# EasyEDA Pro project 赛博樱花灯.epro, schematic SCH_3636_v2
Board Name: c3_8311_3636_v2; Create Date: 2025-01-07; Page Name: P1; Project Name: 小智AI语音对话开发板 - C3; Schematic Name: SCH_3636_v2; Update Date: 2025-01-08; Company: terrence@tenclass.com; Page Size: A4; Version: V2.0
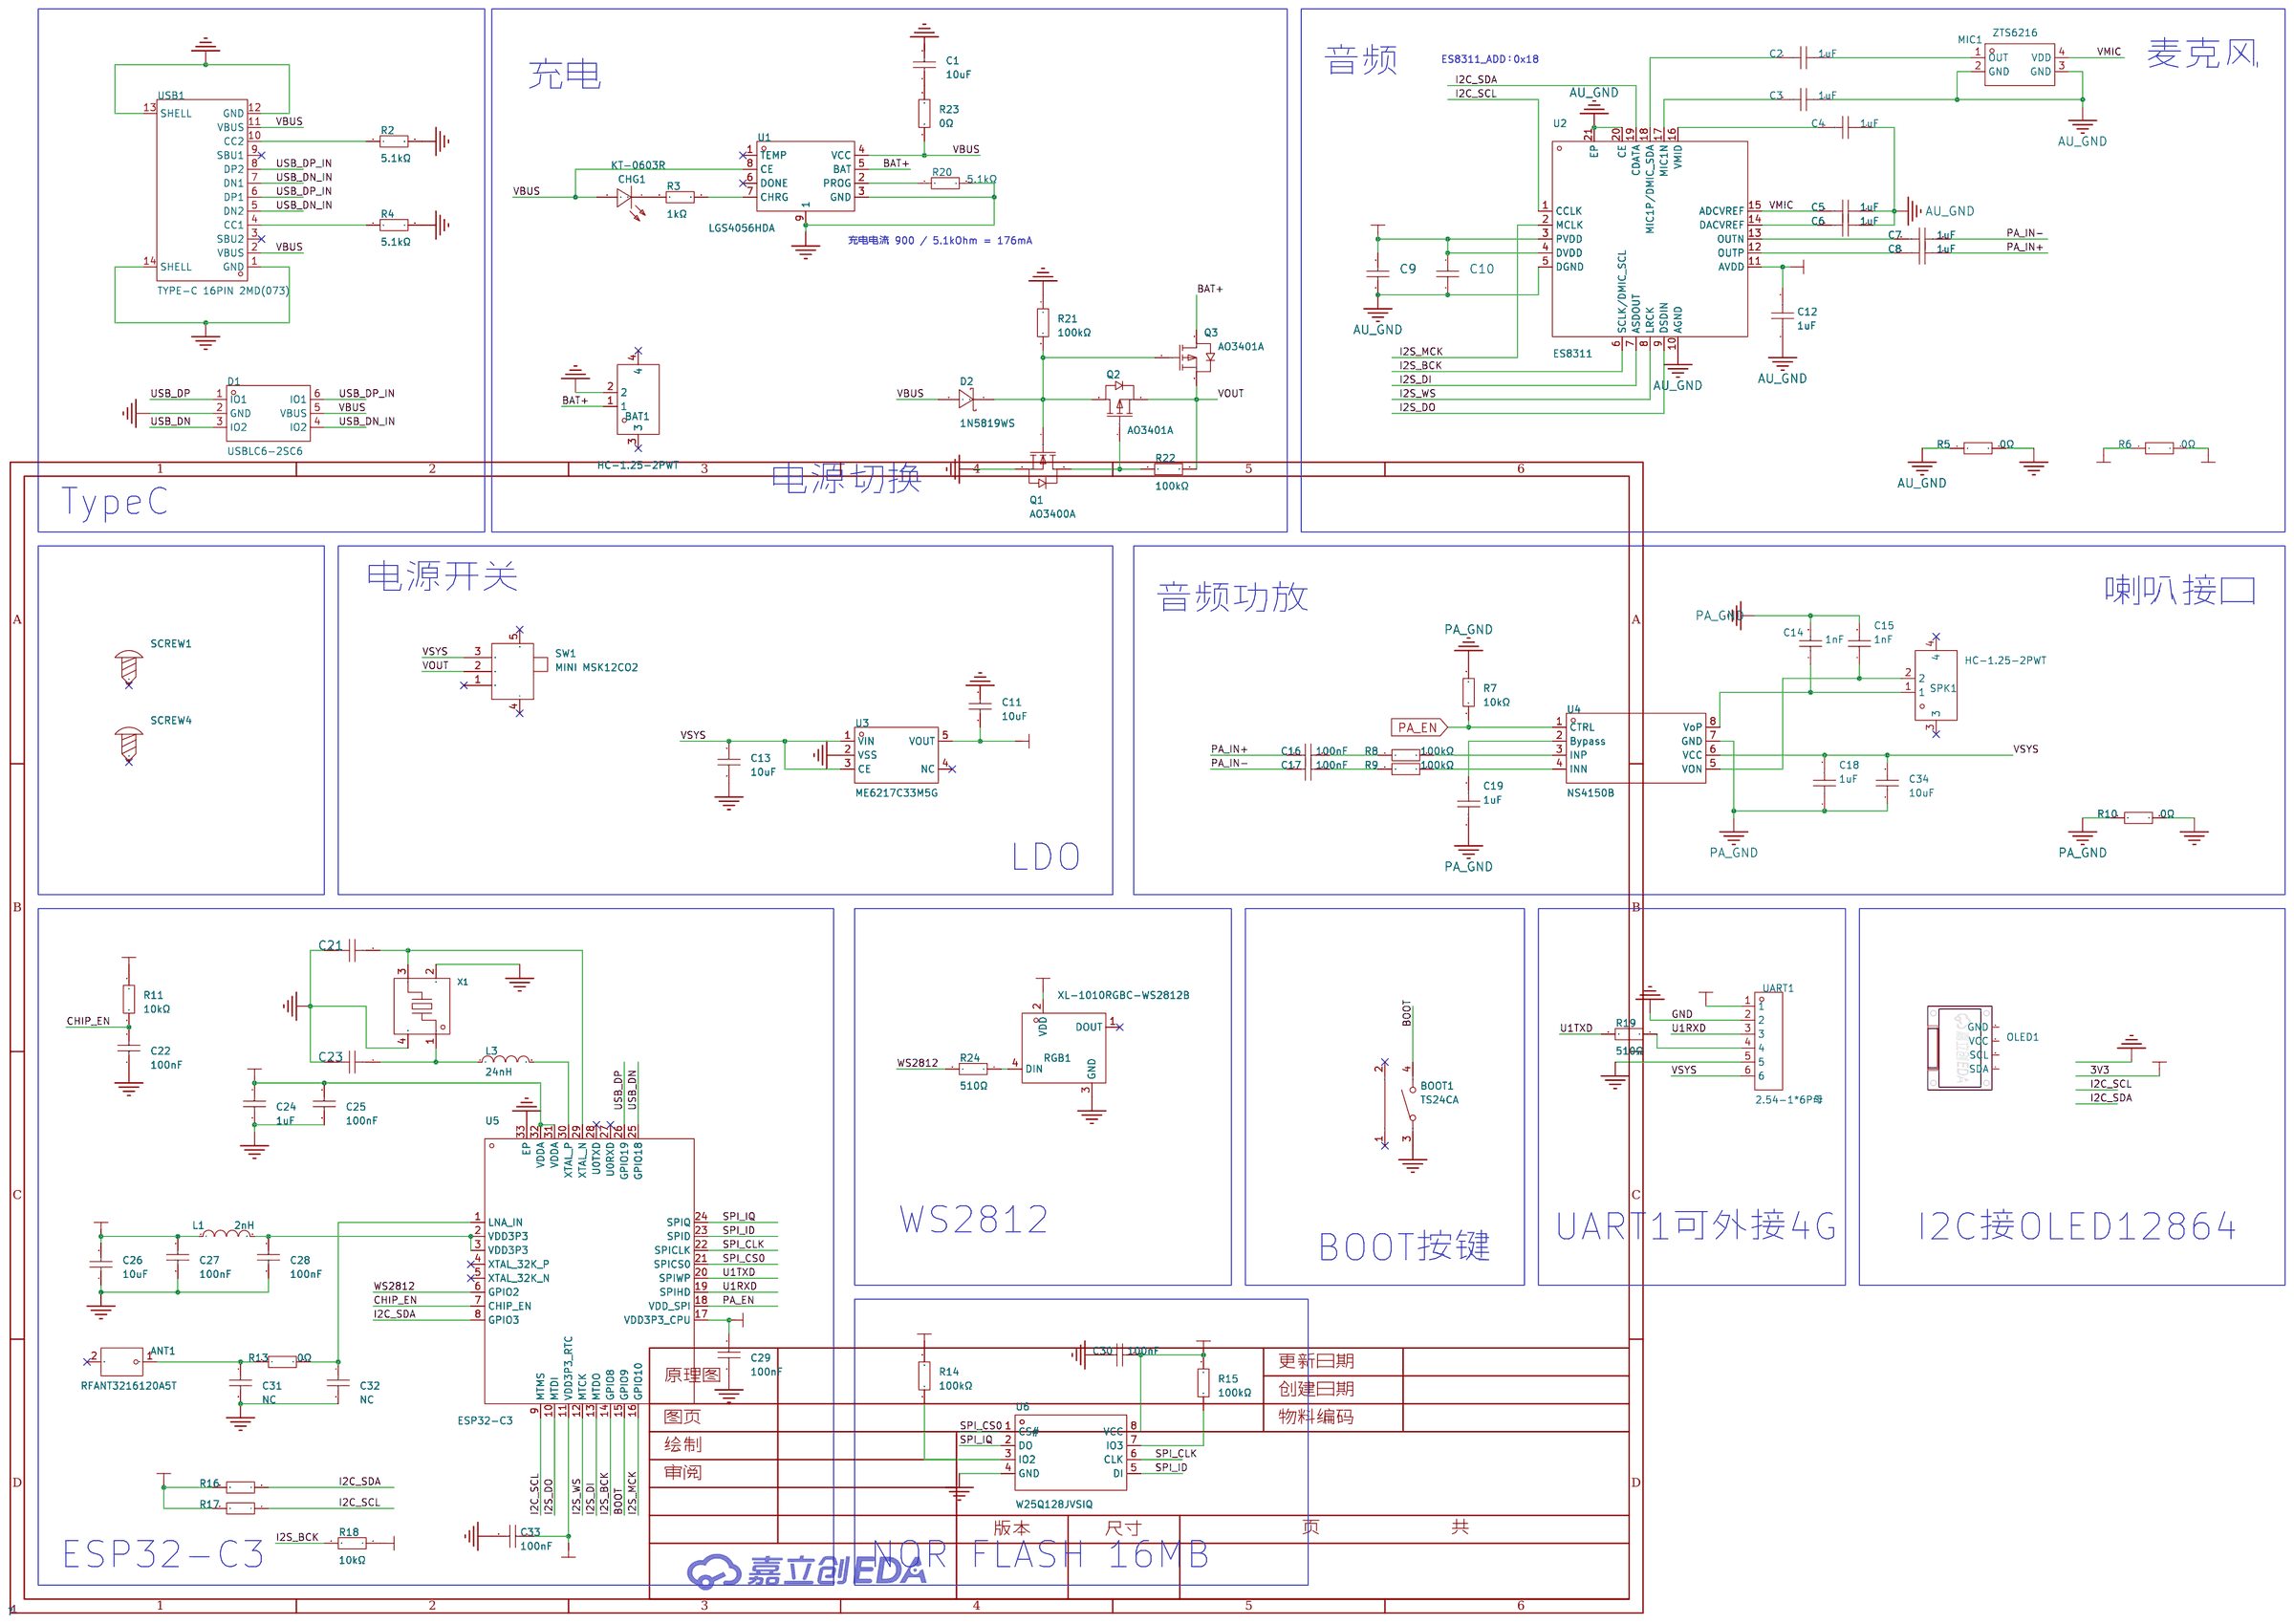
[diagram p4: schematic sheet]

## Parts
ANT1  RFANT3216120A5T  [FILTER-SMD_1206-2P-L3.2-W1.6-L]
BAT1  HC-1.25-2PWT  [CONN-SMD_2P-P1.25-HC-1.25-2PWT]
BOOT1  TS24CA  [SW-SMD_TS24CA]
C1  10uF  [C0402]
C2  1uF  [C0402]
C3  1uF  [C0402]
C4  1uF  [C0402]
C5  1uF  [C0402]
C6  1uF  [C0402]
C7  1uF  [C0402]
C8  1uF  [C0402]
C9  100nF  [C0402]
C10  100nF  [C0402]
C11  10uF  [C0402]
C12  1uF  [C0402]
C13  10uF  [C0402]
C14  1nF  [C0402]
C15  1nF  [C0402]
C16  100nF  [C0402]
C17  100nF  [C0402]
C18  1uF  [C0402]
C19  1uF  [C0402]
C21  10pF  [C0402]
C22  100nF  [C0402]
C23  10pF  [C0402]
C24  1uF  [C0402]
C25  100nF  [C0402]
C26  10uF  [C0402]
C27  100nF  [C0402]
C28  100nF  [C0402]
C29  100nF  [C0402]
C30  100nF  [C0402]
C31  NC  [C0402]
C32  NC  [C0402]
C33  100nF  [C0402]
C34  10uF  [C0402]
CHG1  KT-0603R  [LED0603-RD]
D1  USBLC6-2SC6  [SOT-23-6_L2.9-W1.6-P0.95-LS2.8-BL]
D2  1N5819WS  [SOD-323_L1.8-W1.3-LS2.5-RD]
L1  2nH  [L0402]
L3  24nH  [L0402-RD]
MIC1  ZTS6216  [MIC-SMD_4P-L2.8-W1.9-P1.84-TL]
OLED1  -  [0.96OLED_4P]
Q1  AO3400A  [SOT-23-3_L2.9-W1.3-P1.90-LS2.4-BR]
Q2  AO3401A  [SOT-23_L2.9-W1.3-P1.90-LS2.4-BR]
Q3  AO3401A  [SOT-23_L2.9-W1.3-P1.90-LS2.4-BR]
R2  5.1kΩ  [R0402]
R3  1kΩ  [R0402]
R4  5.1kΩ  [R0402]
R5  0Ω  [R0402]
R6  0Ω  [R0402]
R7  10kΩ  [R0402]
R8  100kΩ  [R0402]
R9  100kΩ  [R0402]
R10  0Ω  [R0402]
R11  10kΩ  [R0402]
R13  0Ω  [R0402]
R14  100kΩ  [R0402]
R15  100kΩ  [R0402]
R16  2.2kΩ  [R0402]
R17  2.2kΩ  [R0402]
R18  10kΩ  [R0402]
R19  510Ω  [R0402]
R20  5.1kΩ  [R0402]
R21  100kΩ  [R0402]
R22  100kΩ  [R0402]
R23  0Ω  [R0402]
R24  510Ω  [R0402]
RGB1  XL-1010RGBC-WS2812B  [LED-SMD_4P-L1.0-W1.0-TL_XL-1010RGBC-WS2812B]
SCREW1  -  [M2螺丝]
SCREW4  -  [M2螺丝]
SPK1  HC-1.25-2PWT  [CONN-SMD_2P-P1.25-HC-1.25-2PWT]
SW1  MINI MSK12CO2  [SW-SMD_MSK12CO2]
U1  LGS4056HDA  [DFN-8_L2.0-W2.0-P0.50-TL-EP1.6]
U2  ES8311  [WQFN-20_L3.0-W3.0-P0.40-BL-EP1.7]
U3  ME6217C33M5G  [SOT-23-5_L3.0-W1.7-P0.95-LS2.8-BR]
U4  NS4150B  [MSOP-8_L3.0-W3.0-P0.65-LS5.0-BL]
U5  ESP32-C3  [QFN-32_L5.0-W5.0-P0.50-TL-EP3.7]
U6  W25Q128JVSIQ  [SOIC-8_L5.3-W5.3-P1.27-LS8.0-BL]
UART1  2.54-1*6P母  [HDR-TH_6P-P2.54-V-F]
USB1  TYPE-C 16PIN 2MD(073)  [USB-C-SMD_TYPE-C-6PIN-2MD-073]
X1  40MHz  [CRYSTAL-SMD_4P-L2.5-W2.0-BL]

## Library data of the parts
ANT1 = RFANT3216120A5T: 天线类型:芯片天线;中心频点:2.4GHz;带宽:-;峰值增益:2dBi;极化方式:-;功率容量:-;驻波比:2;; LCSC Part Name: 2.4GHz ISM频段工作频率的多层陶瓷天线; Supplier Part: C127629; Manufacturer: Walsin(华新科); Supplier Footprint: 1206; JLCPCB Part Class: Extended Part; Datasheet: https://atta.szlcsc.com/upload/public/pdf/source/20180326/C127629_E7A81F7A36316F7BB6F0FA74BB27F225.pdf; Supplier: LCSC; Antenna Type: 芯片天线; Central Frequency: 2.4GHz; Peak Gain: 2dBi; VSWR: 2; Operating Temperature: -40℃~+85℃
BAT1 SPK1 = HC-1.25-2PWT: 插针结构:1x2P;间距:1.25mm;安装方式:卧贴;参考系列:PicoBlade(MX 1.25);总PIN数:2P;排数:1;每排PIN数:2;行距:-;额定电流:1A;触头材质:黄铜;触头镀层:锡;工作温度范围:-40℃~+105℃;; LCSC Part Name: 1x2P 间距:1.25mm 卧贴 系列:PicoBlade(MX 1.25); Supplier Part: C2845379; Manufacturer: HCTL(华灿天禄); Supplier Footprint: SMD,P=1.25mm,卧贴; JLCPCB Part Class: Extended Part; Datasheet: https://atta.szlcsc.com/upload/public/pdf/source/20240930/9508A8292CCC87B0C29E3A028D56E30A.pdf; Supplier: LCSC; Pins Structure: 1x2P; Pitch: 1.25mm; Mounting Style: 卧贴; Reference Series: PicoBlade(MX 1.25); Number of Pins: 2P; Number of Rows: 1; Number of PINs Per Row: 2; Current Rating (Max): 1A; Contact Material: 黄铜; Contact Plating: 锡; Operating Temperature Range: -40℃~+105℃; Rated Voltage (Max): 125V; Plastic Material: LCP; Flame Retardant Rating: UL94V-0; Supplementary Features: 辅助焊脚; Z-Height of the Board: 3.57mm; X-Length of Bottom Edge on Board (Spacing Line): 7.55mm; Y-Width of Bottom Edge on Board: 5.25mm
BOOT1 = TS24CA: 电路结构:单刀单掷;按钮形状:矩形按钮;安装方式:卧贴;开关长度:4.55mm;开关宽度:1.8mm;开关高度:3.5mm;触点电流:50mA;额定电压(DC):12V;带灯:-;机械寿命:-;; LCSC Part Name: 4.55*1.8*3.5mm 卧贴 轻触开关; Supplier Part: C393942; Manufacturer: SHOU HAN(首韩); Supplier Footprint: SMD; JLCPCB Part Class: Extended Part; Datasheet: https://atta.szlcsc.com/upload/public/pdf/source/20190521/C393942_591A9E318887EFA4274D34029981AD99.pdf; Supplier: LCSC; Circuit: 单刀单掷; Actuator Style: 矩形按钮; Mounting Style: 卧贴; Switch Length: 4.55mm; Switch Width: 1.8mm; Switch Height: 3.5mm; Contact Current: 50mA; Voltage Rating (DC): 12V
C1 C11 C13 C26 C34 = CL05A106MQ5NUNC: 容值:10uF;精度:±20%;额定电压:6.3V;材质(温度系数):X5R;; LCSC Part Name: 10uF ±20% 6.3V; Supplier Part: C15525; Manufacturer: SAMSUNG(三星); Supplier Footprint: 0402; JLCPCB Part Class: Basic Part; Datasheet: https://atta.szlcsc.com/upload/public/pdf/source/20220823/2B02EE04F8F211D38A52DCB16EB6BEBA.pdf; Supplier: LCSC; Tolerance: ±20%; Voltage Rated: 6.3V; Temperature Coefficient: X5R
C2 C3 = CL05A105KA5NQNC: 容值:1uF;精度:±10%;额定电压:25V;材质(温度系数):X5R;; LCSC Part Name: 1uF ±10% 25V; Supplier Part: C52923; Manufacturer: SAMSUNG(三星); Supplier Footprint: 0402; JLCPCB Part Class: Basic Part; Datasheet: https://atta.szlcsc.com/upload/public/pdf/source/20160218/1457707763339.pdf; Supplier: LCSC; Tolerance: ±10%; Voltage Rated: 25V; Temperature Coefficient: X5R
C4-C8 C12 C18 C19 = CL05A105KA5NQNC: 容值:1uF;精度:±10%;额定电压:25V;材质(温度系数):X5R;; LCSC Part Name: 1uF ±10% 25V; Supplier Part: C52923; Manufacturer: SAMSUNG(三星); Supplier Footprint: 0402; JLCPCB Part Class: 基础库; Datasheet: https://atta.szlcsc.com/upload/public/pdf/source/20160218/1457707763339.pdf; Supplier: LCSC; Tolerance: ±10%; Voltage Rated: 25V; Temperature Coefficient: X5R; Check: true
C9 C10 = CL05B104KO5NNNC: 容值:100nF;精度:±10%;额定电压:16V;材质(温度系数):X7R;; LCSC Part Name: 100nF ±10% 16V; Supplier Part: C1525; Manufacturer: SAMSUNG(三星); Supplier Footprint: 0402; JLCPCB Part Class: Basic Part; Datasheet: https://atta.szlcsc.com/upload/public/pdf/source/20160218/1457707763339.pdf; Supplier: LCSC; Tolerance: ±10%; Voltage Rated: 16V; Temperature Coefficient: X7R
C14 C15 = 0402B102K500NT: 容值:1nF;精度:±10%;额定电压:50V;材质(温度系数):X7R;; LCSC Part Name: 1nF ±10% 50V; Supplier Part: C1523; Manufacturer: FH(风华); Supplier Footprint: 0402; JLCPCB Part Class: Basic Part; Datasheet: https://atta.szlcsc.com/upload/public/pdf/source/20200305/C486355_26A10D38EF8C2A5C37091D0039909270.pdf; Supplier: LCSC; Tolerance: ±10%; Voltage Rated: 50V; Temperature Coefficient: X7R
C16 C17 C22 C25 C27-C30 C33 = CL05B104KO5NNNC: 容值:100nF;精度:±10%;额定电压:16V;材质(温度系数):X7R;; LCSC Part Name: 100nF ±10% 16V; Supplier Part: C1525; Manufacturer: SAMSUNG(三星); Supplier Footprint: 0402; JLCPCB Part Class: 基础库; Datasheet: https://atta.szlcsc.com/upload/public/pdf/source/20160218/1457707763339.pdf; Supplier: LCSC; Tolerance: ±10%; Voltage Rated: 16V; Temperature Coefficient: X7R; Check: true
C21 C23 = CL05C100JB5NNNC: 容值:10pF;精度:±5%;额定电压:50V;材质(温度系数):C0G;; LCSC Part Name: 10pF ±5% 50V; Supplier Part: C32949; Manufacturer: SAMSUNG(三星); Supplier Footprint: 0402; JLCPCB Part Class: Basic Part; Datasheet: https://atta.szlcsc.com/upload/public/pdf/source/20160218/1457707763339.pdf; Supplier: LCSC; Tolerance: ±5%; Voltage Rated: 50V; Temperature Coefficient: C0G
C24 = CL05A105KA5NQNC: 容值:1uF;精度:±10%;额定电压:25V;材质(温度系数):X5R;; LCSC Part Name: 1uF ±10% 25V; Supplier Part: C52923; Manufacturer: SAMSUNG(三星); Supplier Footprint: 0402; JLCPCB Part Class: Basic Part; Datasheet: https://atta.szlcsc.com/upload/public/pdf/source/20160218/1457707763339.pdf; Supplier: LCSC; Tolerance: ±10%; Voltage Rated: 25V; Temperature Coefficient: X5R; Check: true
C31 C32 = CL05B104KO5NNNC: 容值:100nF;精度:±10%;额定电压:16V;材质(温度系数):X7R;; LCSC Part Name: 100nF ±10% 16V; Supplier Part: C1525; Manufacturer: SAMSUNG(三星); Supplier Footprint: 0402; JLCPCB Part Class: 基础库; Datasheet: https://atta.szlcsc.com/upload/public/pdf/source/20160218/1457707763339.pdf; Supplier: LCSC; Tolerance: ±10%; Voltage Rated: 16V; Temperature Coefficient: X7R
CHG1 = KT-0603R: 发光颜色:红色;功率:-;正向电流:-;主波长:-;二极管配置:-;透镜颜色:-;色温:-;发光角度:-;载带方式:-;工作温度:-40℃~+85℃;; LCSC Part Name: 0603 红灯 高亮; Supplier Part: C2286; Manufacturer: KENTO; Supplier Footprint: 0603; JLCPCB Part Class: 基础库; Datasheet: https://atta.szlcsc.com/upload/public/pdf/source/20160616/1466072038404.pdf; Supplier: LCSC; Emitted Color: 红色; Operating Temperature: -40℃~+85℃
D1 = USBLC6-2SC6_C2827654: 极性:单向;反向截止电压(Vrwm):5V;最大钳位电压:12V;峰值脉冲电流(Ipp):6A;峰值脉冲功率(Ppp):150W;击穿电压:6V;; LCSC Part Name: ESD，可防30kV静电; Supplier Part: C2827654; Manufacturer: TECH PUBLIC(台舟); Supplier Footprint: SOT-23-6; JLCPCB Part Class: 扩展库; Datasheet: https://atta.szlcsc.com/upload/public/pdf/source/20210810/FBD75DE717D6D97BAC6DD7F2B5C09DCD.pdf; Supplier: LCSC; polarity: 单向; Reverse Stand-Off Voltage (Vrwm): 5V; Maximum Clamping Voltage: 12V; Peak Pulse Current (Ipp): 6A; Peak Pulse Power Dissipation (Ppp): 150W; Breakdown Voltage: 6V; Reverse Leakage Current (Ir): 80nA; Number of Lines: 双路; Operating Temperature: -55℃~+125℃; level of protection: IEC 61000-4-2; Type: ESD
D2 = 1N5819WS_C191023: 正向压降(Vf):600mV@1A;直流反向耐压(Vr):40V;平均整流电流(Io):1A;; LCSC Part Name: 电压:40V 电流:1A; Supplier Part: C191023; Manufacturer: Hottech(合科泰); Supplier Footprint: SOD-323; JLCPCB Part Class: 基础库; Datasheet: https://atta.szlcsc.com/upload/public/pdf/source/20220428/3CB86FD8D28D653594B4E35F9D5AEFD9.pdf; Supplier: LCSC; Forward Voltage (Vf@If): 600mV@1A; Reverse Voltage (Vr): 40V; Average Rectified Current (Io): 1A
L1 = LQG15HS2N0S02D: 电感值:2nH;精度:-;额定电流:900mA;饱和电流(Isat):-;直流电阻(DCR):90mΩ;; LCSC Part Name: 2nH ±0.3nH; Supplier Part: C18216; Manufacturer: muRata(村田); Supplier Footprint: 0402; Datasheet: https://atta.szlcsc.com/upload/public/pdf/source/20190514/C18216_4C6D770518CF7A3B206943E09D2940CE.pdf; Supplier: LCSC; Rated Current: 900mA; DC Resistance (DCR): 90mΩ; Q @ Freq: 8@100MHz; Frequency - Self Resonant: 6GHz; Check: true
L3 = SDCL1005C24NJTDF: 电感值:24nH;精度:±5%;额定电流:-;饱和电流(Isat):-;直流电阻(DCR):-;; LCSC Part Name: 24nH ±5%; Supplier Part: C74301; Manufacturer: Sunlord(顺络); Supplier Footprint: 0402; Datasheet: https://atta.szlcsc.com/upload/public/pdf/source/20210916/2389196E6DC4CA1121B2D3610B126F46.pdf; Supplier: LCSC; Tolerance: ±5%; Check: true
MIC1 = ZTS6216: 方向:全指向;信噪比:65dB;灵敏度:-38dB;阻抗:100Ω;; Supplier Part: C481302; Manufacturer: ZILLTEK(钰太); Supplier Footprint: SMD-4P,1.9x2.8mm; JLCPCB Part Class: Extended Part; Datasheet: https://atta.szlcsc.com/upload/public/pdf/source/20200316/C481302_3CBECE2A7DED4DFD53CEA082844189F4.pdf; Supplier: LCSC; Direction: 全指向; Sensitivity: -38dB; SNR(Signal to Noise Ratio): 65dB; Current Consumption: 120uA; Supply Voltage: 1.5V~3.6V; Impedance: 100Ω
OLED1 = 0.96OLED模块_4P: Supplier Footprint: 插件
Q1 = AO3400A_C20917: 类型:1个N沟道;漏源电压(Vdss):30V;连续漏极电流(Id):5.7A;导通电阻(RDS(on)@Vgs,Id):26.5mΩ@10V,5.7A;功率(Pd):1.4W;阈值电压(Vgs(th)@Id):1.5V@250uA;; LCSC Part Name: 1个N沟道 耐压:30V 电流:5.7A; Supplier Part: C20917; Manufacturer: AOS; Supplier Footprint: SOT-23-3L; JLCPCB Part Class: 基础库; Datasheet: https://atta.szlcsc.com/upload/public/pdf/source/20140107/1457706668533.pdf; Supplier: LCSC; Type: 1个N沟道; Drain Source Voltage (Vdss): 30V; Continuous Drain Current (Id): 5.7A; Drain Source On Resistance (RDS(on)@Vgs,Id): 26.5mΩ@10V,5.7A; Power Dissipation (Pd): 1.4W; Gate Threshold Voltage (Vgs(th)@Id): 1.5V@250uA; Total Gate Charge (Qg@Vgs): 7nC@4.5V; Input Capacitance (Ciss@Vds): 630pF@15V; Operating Temperature: -55℃~+150℃@(Tj)
Q2 Q3 = AO3401A_C15127: 类型:1个P沟道;漏源电压(Vdss):30V;连续漏极电流(Id):4A;导通电阻(RDS(on)@Vgs,Id):44mΩ@10V,4.3A;功率(Pd):1.4W;阈值电压(Vgs(th)@Id):1.3V@250uA;; LCSC Part Name: 1个P沟道 耐压:30V 电流:4A; Supplier Part: C15127; Manufacturer: AOS; Supplier Footprint: SOT-23; JLCPCB Part Class: 基础库; Datasheet: https://atta.szlcsc.com/upload/public/pdf/source/20160507/1462613609053.pdf; Supplier: LCSC; Type: 1个P沟道; Drain Source Voltage (Vdss): 30V; Continuous Drain Current (Id): 4A; Drain Source On Resistance (RDS(on)@Vgs,Id): 44mΩ@10V,4.3A; Power Dissipation (Pd): 1.4W; Gate Threshold Voltage (Vgs(th)@Id): 1.3V@250uA; Total Gate Charge (Qg@Vgs): 12.2nC@4.5V; Input Capacitance (Ciss@Vds): 1.2nF@15V; Operating Temperature: -55℃~+150℃@(Tj)
R2 R4 R20 = 0402WGF5101TCE: 电阻类型:厚膜电阻;阻值:5.1kΩ;精度:±1%;功率:62.5mW;最大工作电压:50V;温度系数:±100ppm/℃;; LCSC Part Name: 5.1kΩ ±1% 62.5mW 厚膜电阻; Supplier Part: C25905; Manufacturer: UNI-ROYAL(厚声); Supplier Footprint: 0402; JLCPCB Part Class: 基础库; Datasheet: https://atta.szlcsc.com/upload/public/pdf/source/20200306/C422600_1E6D84923E4A46A82E41ADD87F860B5C.pdf; Supplier: LCSC; Type: 厚膜电阻; Tolerance: ±1%; Power(Watts): 62.5mW; Overload Voltage (Max): 50V; Temperature Coefficient: ±100ppm/℃; Operating Temperature Range: -55℃~+155℃; Check: true
R3 = 0402WGF1001TCE: 电阻类型:厚膜电阻;阻值:1kΩ;精度:±1%;功率:62.5mW;最大工作电压:50V;温度系数:±100ppm/℃;; LCSC Part Name: 1kΩ ±1% 62.5mW 厚膜电阻; Supplier Part: C11702; Manufacturer: UNI-ROYAL(厚声); Supplier Footprint: 0402; JLCPCB Part Class: Basic Part; Datasheet: https://atta.szlcsc.com/upload/public/pdf/source/20200306/C422600_1E6D84923E4A46A82E41ADD87F860B5C.pdf; Supplier: LCSC; Type: 厚膜电阻; Tolerance: ±1%; Power(Watts): 62.5mW; Overload Voltage (Max): 50V; Temperature Coefficient: ±100ppm/℃; Operating Temperature Range: -55℃~+155℃
R5 R6 R10 R23 = 0402WGF0000TCE: 电阻类型:厚膜电阻;阻值:0Ω;精度:±1%;功率:62.5mW;; LCSC Part Name: 0Ω ±1% 62.5mW; Supplier Part: C17168; Manufacturer: UNI-ROYAL(厚声); Supplier Footprint: 0402; Datasheet: https://atta.szlcsc.com/upload/public/pdf/source/20200306/C422600_1E6D84923E4A46A82E41ADD87F860B5C.pdf; Supplier: LCSC; Type: 厚膜电阻; Tolerance: ±1%; Power(Watts): 62.5mW; Temperature Coefficient: ±800ppm/℃; Overload Voltage (Max): 50V; Operating Temperature Range: -55℃~+155℃; Check: true
R7 R11 R18 = 0402WGF1002TCE: 电阻类型:厚膜电阻;阻值:10kΩ;精度:±1%;功率:62.5mW;最大工作电压:50V;温度系数:±100ppm/℃;; LCSC Part Name: 10kΩ ±1% 62.5mW 厚膜电阻; Supplier Part: C25744; Manufacturer: UNI-ROYAL(厚声); Supplier Footprint: 0402; JLCPCB Part Class: 基础库; Datasheet: https://atta.szlcsc.com/upload/public/pdf/source/20200306/C422600_1E6D84923E4A46A82E41ADD87F860B5C.pdf; Supplier: LCSC; Type: 厚膜电阻; Tolerance: ±1%; Power(Watts): 62.5mW; Overload Voltage (Max): 50V; Temperature Coefficient: ±100ppm/℃; Operating Temperature Range: -55℃~+155℃; Check: true
R8 R9 R14 R15 R21 R22 = 0402WGF1003TCE: 电阻类型:厚膜电阻;阻值:100kΩ;精度:±1%;功率:62.5mW;; LCSC Part Name: 100kΩ ±1% 62.5mW; Supplier Part: C25741; Manufacturer: UNI-ROYAL(厚声); Supplier Footprint: 0402; JLCPCB Part Class: 基础库; Datasheet: https://atta.szlcsc.com/upload/public/pdf/source/20200306/C422600_1E6D84923E4A46A82E41ADD87F860B5C.pdf; Supplier: LCSC; Type: 厚膜电阻; Tolerance: ±1%; Power(Watts): 62.5mW; Temperature Coefficient: ±100ppm/℃; Overload Voltage (Max): 50V; Operating Temperature Range: -55℃~+155℃; Check: true
R13 = 0402WGF0000TCE: 电阻类型:厚膜电阻;阻值:0Ω;精度:±1%;功率:62.5mW;最大工作电压:50V;温度系数:±800ppm/℃;; LCSC Part Name: 0Ω ±1% 62.5mW; Supplier Part: C17168; Manufacturer: UNI-ROYAL(厚声); Supplier Footprint: 0402; JLCPCB Part Class: Basic Part; Datasheet: https://atta.szlcsc.com/upload/public/pdf/source/20200306/C422600_1E6D84923E4A46A82E41ADD87F860B5C.pdf; Supplier: LCSC; Type: 厚膜电阻; Tolerance: ±1%; Power(Watts): 62.5mW; Temperature Coefficient: ±800ppm/℃; Overload Voltage (Max): 50V; Operating Temperature Range: -55℃~+155℃; Check: true
R16 R17 = 0402WGF2201TCE: 电阻类型:厚膜电阻;阻值:2.2kΩ;精度:±1%;功率:62.5mW;最大工作电压:50V;温度系数:±100ppm/℃;; LCSC Part Name: 2.2kΩ ±1% 62.5mW 厚膜电阻; Supplier Part: C25879; Manufacturer: UNI-ROYAL(厚声); Supplier Footprint: 0402; JLCPCB Part Class: Basic Part; Datasheet: https://atta.szlcsc.com/upload/public/pdf/source/20200306/C422600_1E6D84923E4A46A82E41ADD87F860B5C.pdf; Supplier: LCSC; Type: 厚膜电阻; Tolerance: ±1%; Power(Watts): 62.5mW; Overload Voltage (Max): 50V; Temperature Coefficient: ±100ppm/℃; Operating Temperature Range: -55℃~+155℃
R19 R24 = 0402WGF5100TCE: 电阻类型:厚膜电阻;阻值:510Ω;精度:±1%;功率:62.5mW;最大工作电压:50V;温度系数:±100ppm/℃;; LCSC Part Name: 510Ω ±1% 62.5mW 厚膜电阻; Supplier Part: C25123; Manufacturer: UNI-ROYAL(厚声); Supplier Footprint: 0402; JLCPCB Part Class: Basic Part; Datasheet: https://atta.szlcsc.com/upload/public/pdf/source/20200306/C422600_1E6D84923E4A46A82E41ADD87F860B5C.pdf; Supplier: LCSC; Type: 厚膜电阻; Tolerance: ±1%; Power(Watts): 62.5mW; Overload Voltage (Max): 50V; Temperature Coefficient: ±100ppm/℃; Operating Temperature Range: -55℃~+155℃
RGB1 = XL-1010RGBC-WS2812B: 0404幻彩/1010幻彩 ws2812B 内置驱动IC 小尺寸幻彩; Supplier Part: C5349953; Manufacturer: XINGLIGHT(成兴光); Supplier Footprint: SMD,1x1mm; JLCPCB Part Class: Extended Part; Datasheet: https://atta.szlcsc.com/upload/public/pdf/source/20240218/17D2BD8F4295D202E0F5662BF6E5539A.pdf; Supplier: LCSC
SCREW1 SCREW4 = M2螺丝: Supplier Footprint: 插件
SW1 = MINI MSK12CO2: 电路结构:单刀双掷;安装方式:卧贴;开关颜色:-;额定电流(DC):50mA;额定电压(DC):12V;额定电流(AC):-;额定电压(AC):-;机械寿命:1万次;; LCSC Part Name: 迷你七脚两档侧拨拨动 mini七7脚 微型拨动; Supplier Part: C2681570; Manufacturer: SHOU HAN(首韩); Supplier Footprint: SMD; JLCPCB Part Class: 扩展库; Datasheet: https://atta.szlcsc.com/upload/public/pdf/source/20210224/C2681570_D263F9C605E4588A4AE6114B72AE4C72.pdf; Supplier: LCSC; Circuit: 单刀双掷; Pin Style: SMD接片; Switch Length: 5mm; Switch Width: 2.75mm; Switch Height: 1.4mm; Mounting Style: 卧贴; Current Rating (DC): 50mA; Voltage Rating (DC): 12V; Mechanical Life: 1万次; Operating Temperature: -16℃~+60℃
U1 = LGS4056HDA: 电源电压:4V~6V;最大充电电流:1A;电池类型:锂离子/聚合物;电池节数:1;; LCSC Part Name: TP4056H(DFN); Supplier Part: C5124109; Manufacturer: Legend-Si(棱晶半导体); Supplier Footprint: DFN-8(2x2); JLCPCB Part Class: 扩展库; Datasheet: https://atta.szlcsc.com/upload/public/pdf/source/20230407/EF281A5928E4D64337F5505487E44644.pdf; Supplier: LCSC; The Chip Type: 线性充电芯片; Supply Voltage: 4V~6V; Maximum Charge Current: 1A; Charging Saturation Voltage: 4.2V; Type of Battery: 锂离子/聚合物; Number of Cells: 1; Operating Temperature: -40℃~+125℃
U2 = ES8311: Supplier Part: C962342; Manufacturer: Everest-semi(顺芯); Supplier Footprint: WQFN-20-EP(3x3); JLCPCB Part Class: 扩展库; Datasheet: https://atta.szlcsc.com/upload/public/pdf/source/20210630/C962342_E665EAE7274179BC7C5A390EC8AC685C.pdf; Supplier: LCSC; Check: true
U3 = ME6217C33M5G: 输出类型:固定;输出极性:正;最大输入电压:7V;输出电压:3.3V;输出电流:800mA;电源纹波抑制比(PSRR):65dB@(1kHz);; Supplier Part: C427602; Manufacturer: MICRONE(南京微盟); Supplier Footprint: SOT-23-5; Datasheet: https://atta.szlcsc.com/upload/public/pdf/source/20190910/C427602_D4B9162A2E9D9EF57C60010DFDECEF37.pdf; Supplier: LCSC; Output Type: 固定; Output Polarity: 正; Number of Outputs: 1; Maximum Input Voltage: 7V; Output Voltage: 3.3V; Dropout Voltage: 180mV@(300mA); Output Current: 800mA; Power Supply Rejection Ratio (PSRR): 65dB@(1kHz); Check: true
U4 = NS4150B_C189961: 功放类型:Class D;输出功率:3Wx1@4Ω;; Supplier Part: C189961; Manufacturer: Nsiway(纳芯威); Supplier Footprint: MSOP-8; Datasheet: https://atta.szlcsc.com/upload/public/pdf/source/20220916/DAE631F3909B9CBB38BDE76E3E6D5896.pdf; Supplier: LCSC; Type of Power Amplifier: Class D; Output Power: 3Wx1@4Ω; Supply Voltage: 3V~5.25V; Check: true
U5 = ESP32-C3: CPU内核:RISC-V;CPU最大主频:160MHz;工作电压范围:3V~3.6V;程序存储容量:-;程序存储器类型:-;RAM总容量:400KB;GPIO端口数量:22;; Supplier Part: C2838500; Manufacturer: ESPRESSIF(乐鑫); Supplier Footprint: QFN-32-EP(5x5); JLCPCB Part Class: 扩展库; Datasheet: https://atta.szlcsc.com/upload/public/pdf/source/20210625/C2838500_6489BE4707B1A2880AF92BF6724D19CA.pdf; Supplier: LCSC; CPU Core: RISC-V; CPU Maximum Speed: 160MHz; Operating Voltage Range: 3V~3.6V; RAM Size: 400KB; GPIO Ports Number: 22; ADC (Bit): 12bit; UART/USART: 2; I2C: 1; I2S: 1; SPI: 3; Peripheral/Function: 蓝牙协议栈；片载温度传感器；真随机数发生器；DMA；看门狗；WIFI协议栈；硬件密码算法引擎；54位Timer；PWM；RTC实时时钟; communication protocol: 蓝牙协议；WIFI协议; Watchdog: 有; Real-Time Clock: 有; Direct Memory Access: 有; Operating Temperature Range: -40℃~+105℃; Check: true
U6 = W25Q128JVSIQ: 接口类型:SPI;存储容量:128Mbit;时钟频率(fc):133MHz;; LCSC Part Name: W25Q128JVSIQ 编带; Supplier Part: C97521; Manufacturer: WINBOND(华邦); Supplier Footprint: SOIC-8-208mil; JLCPCB Part Class: 基础库; Datasheet: https://atta.szlcsc.com/upload/public/pdf/source/20170316/1489627409956.pdf; Supplier: LCSC; Interface Type: SPI; Memory Size: 128Mbit; Clock Frequency (fc): 133MHz; Supply Voltage: 2.7V~3.6V; Page Programming Time (Tpp): 700us; Block Erase Time (tBE): 120ms@(32KB); Data Retention - TDR (Year): 20年; Operating Temperature: -40℃~+85℃; Check: true
UART1 = 2.54-1*6P母: 插孔结构:1x6P;间距:2.54mm;行距:-;安装类型:直插;排数:单排;总孔位数:6P;塑高:-;触头材质:-;触头镀层:-;; LCSC Part Name: 间距:2.54mm 1x6P 直插; Supplier Part: C40877; Manufacturer: BOOMELE(博穆精密); Supplier Footprint: 插件,P=2.54mm; JLCPCB Part Class: Extended Part; Datasheet: https://atta.szlcsc.com/upload/public/pdf/source/20210301/C2718488_F4427B881E42CAA8DDB0B1C12B3A522C.pdf; Supplier: LCSC; Holes Structure: 1x6P; Pitch: 2.54mm; Mounting Type: 直插; Number of Rows: 单排; Number of Holes: 6P
USB1 = TYPE-C 16PIN 2MD(073): 连接器类型:Type-C;标准:USB 3.1;公母:母;安装方式:卧贴;触点数量:16P;端口数量:1;额定电流 - 电源:5A;工作温度范围:-25℃~+85℃;; LCSC Part Name: Type-C 母 卧贴; Supplier Part: C2765186; Manufacturer: SHOU HAN(首韩); Supplier Footprint: SMD; JLCPCB Part Class: 扩展库; Datasheet: https://atta.szlcsc.com/upload/public/pdf/source/20211123/39B17C16241EAC15C5E277BDA434118E.pdf; Supplier: LCSC; Connector Type: Type-C; Standard: USB 3.1; Gender: 母; Mounting Style: 卧贴; Number of Contacts: 16P; Number of Ports: 1; Current Rating - Power (Max): 5A; Operating Temperature Range: -25℃~+85℃; Rated Voltage (Max): 5V; Connect-Disconnect Life: 5千次; Core Colour: 黑色; Check: true
X1 = X252040MMB4SI: 晶振类型:贴片晶振;频率:40MHz;常温频差:±10ppm;外接负载电容:10pF;频率稳定度(全温):±20ppm;; LCSC Part Name: 40MHz ±10ppm 10pF; Supplier Part: C2885592; Manufacturer: YXC(扬兴晶振); Supplier Footprint: SMD2520-4P; JLCPCB Part Class: Extended Part; Datasheet: https://atta.szlcsc.com/upload/public/pdf/source/20240329/8B53C0AFBC5BB264DFB5D72B3757797A.pdf; Supplier: LCSC; Crystal Type: 贴片晶振; Normal temperature Frequency Tolerance: ±10ppm; External load capacitor: 10pF; Frequency Stability(Full temperature range): ±20ppm; Operating Temperature: -40℃~+85℃

## Nets
3V3: C11.1 C24.1 C25.1 C26.2 C27.1 C29.1 C30.1 C33.1 L1.1 R6.2 R11.1 R14.2 R15.2 R16.2 R17.2 R18.1 U3.5(VOUT) U5.11(VDD3P3_RTC) U5.17(VDD3P3_CPU) U5.31(VDDA) U5.32(VDDA) U6.8(VCC) UART1.1
GND: BAT1.2 BOOT1.3 C1.1 C11.2 C13.1 C21.2 C22.2 C23.2 C24.2 C25.2 C26.1 C27.2 C28.2 C29.2 C30.2 C31.2 C32.2 C33.2 D1.2(GND) Q1.2(S) R2.2 R4.2 R5.2 R10.2 R20.2 R21.1 RGB1.3(GND) U1.3(GND) U1.9(1) U3.2(VSS) U5.33(EP) U6.4(GND) UART1.2 UART1.5 USB1.1(GND) USB1.12(GND) USB1.13(SHELL) USB1.14(SHELL) X1.2(GND) X1.4(GND)
VBUS: CHG1.2(A) D1.5(VBUS) D2.2(A) R23.1 U1.4(VCC) U1.8(CE) USB1.2(VBUS) USB1.11(VBUS)
AU_3V3: C9.2 C10.2 C12.2 R6.1 U2.3(PVDD) U2.4(DVDD) U2.11(AVDD)
AU_GND: C3.1 C4.1 C5.1 C6.1 C9.1 C10.1 C12.1 MIC1.2(GND) MIC1.3(GND) R5.1 U2.5(DGND) U2.10(AGND) U2.20(CE) U2.21(EP)
BAT+: BAT1.1 Q3.3(D) U1.5(BAT)
BOOT: BOOT1.4 U5.15(GPIO9)
CHIP_EN: C22.1 R11.2 U5.7(CHIP_EN)
I2C_SCL: R17.1 U2.1(CCLK) U5.9(MTMS)
I2C_SDA: R16.1 U2.19(CDATA) U5.8(GPIO3)
I2S_BCK: R18.2 U2.6(SCLK/DMIC_SCL) U5.14(GPIO8)
I2S_DI: U2.7(ASDOUT) U5.13(MTDO)
I2S_DO: U2.9(DSDIN) U5.10(MTDI)
I2S_MCK: U2.2(MCLK) U5.16(GPIO10)
I2S_WS: U2.8(LRCK) U5.12(MTCK)
PA_EN: R7.1 U4.1(CTRL) U5.18(VDD_SPI)
PA_GND: C14.2 C15.2 C18.1 C19.1 C34.1 R7.2 R10.1 U4.7(GND)
PA_IN+: C8.1 C16.1
PA_IN-: C7.1 C17.1
SPI_CLK: U5.22(SPICLK) U6.6(CLK)
SPI_CS0: U5.21(SPICS0) U6.1(CS#)
SPI_ID: U5.23(SPID) U6.5(DI)
SPI_IQ: U5.24(SPIQ) U6.2(DO)
U1RXD: U5.19(SPIHD) UART1.3
U1TXD: R19.2 U5.20(SPIWP)
USB_DN: D1.3(IO2) U5.25(GPIO18)
USB_DN_IN: D1.4(IO2) USB1.5(DN2) USB1.7(DN1)
USB_DP: D1.1(IO1) U5.26(GPIO19)
USB_DP_IN: D1.6(IO1) USB1.6(DP1) USB1.8(DP2)
VMIC: C5.2 MIC1.4(VDD) U2.15(ADCVREF)
VOUT: Q2.2(S) Q3.2(S) R22.2 SW1.2
VSYS: C13.2 C18.2 C34.2 RGB1.2(VDD) SW1.3 U3.1(VIN) U3.3(CE) U4.6(VCC) UART1.6
WS2812: R24.2 U5.6(GPIO2)
$1N629: R2.1 USB1.10(CC2)
$1N642: R4.1 USB1.4(CC1)
$1N2096: ANT1.1 C31.1 R13.1
$1N2098: C32.1 R13.2 U5.1(LNA_IN)
$1N2123: C28.1 L1.2 U5.2(VDD3P3) U5.3(VDD3P3)
$1N2158: C21.1 U5.29(XTAL_N) X1.3
$1N2350: R14.1 U6.3(IO2)
$1N2553: R15.1 U6.7(IO3)
$1N5759: C8.2 U2.12(OUTP)
$1N5760: C7.2 U2.13(OUTN)
$1N5772: C6.2 U2.14(DACVREF)
$1N5774: C4.2 U2.16(VMID)
$1N5775: C3.2 U2.17(MIC1N)
$1N5776: C2.2 U2.18(MIC1P/DMIC_SDA)
$1N6630: R8.1 U4.3(INP)
$1N6631: R9.1 U4.4(INN)
$1N6634: C19.2 U4.2(Bypass)
$1N6639: C16.2 R8.2
$1N6640: C17.2 R9.2
$1N6885: R19.1 UART1.4
$1N19600: CHG1.1(K) R3.1
$1N19641: R3.2 U1.7(CHRG)
$1N26968: C2.1 MIC1.1(OUT)
$1N27561: C15.1 SPK1.2 U4.5(VON)
$1N29918: C14.1 SPK1.1 U4.8(VoP)
$1N30665: R20.1 U1.2(PROG)
$1N42663: L3.2 U5.30(XTAL_P)
$1N42668: C23.1 L3.1 X1.1
$1N47594: D2.1(K) Q1.1(G) Q2.3(D) Q3.1(G) R21.2
$1N47654: Q1.3(D) Q2.1(G) R22.1
$1N52868: C1.2 R23.2
$1N55724: R24.1 RGB1.4(DIN)

Not connected (* = marked no-connect by the designer): ANT1 2*; BAT1 3* 4*; BOOT1 1* 2*; OLED1 1(GND) 2(VCC) 3(SCL) 4(SDA); RGB1 1(DOUT)*; SCREW1 1*; SCREW4 1*; SPK1 3* 4*; SW1 1* 4* 5*; U1 1(TEMP)* 6(DONE)*; U3 4(NC)*; U5 4(XTAL_32K_P)* 5(XTAL_32K_N)* 27(U0RXD)* 28(U0TXD)*; USB1 3(SBU2)* 9(SBU1)*

## Notes on the sheet
- ES8311_ADD：0x18
- 音频
- 麦克风
- 充电
- 充电电流 900 / 5.1kOhm = 176mA
- 电源切换
- TypeC
- 电源开关
- 喇叭接口
- 音频功放
- LDO
- WS2812
- UART1可外接4G
- I2C接OLED12864
- BOOT按键
- ESP32-C3
- NOR FLASH 16MB
